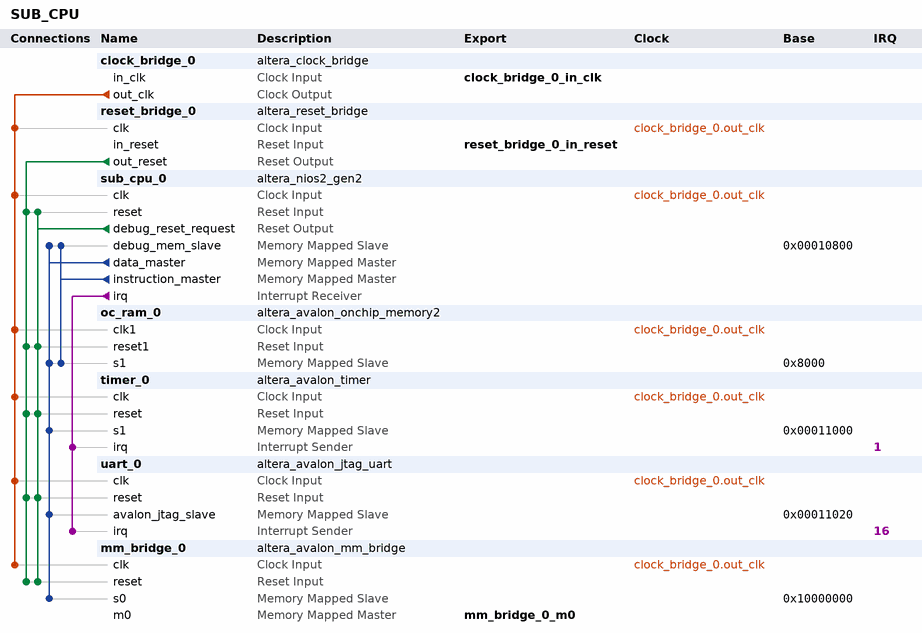
[diagram p0: system contents]
# Platform Designer (Qsys) system SUB_CPU, Cyclone IV E EP4CE115F29C7
# Parameters at their usual value, and those the tool derives, are not listed.
package require -exact qsys 18.1
create_system SUB_CPU
set_project_property DEVICE_FAMILY {Cyclone IV E}
set_project_property DEVICE EP4CE115F29C7

add_instance clock_bridge_0 altera_clock_bridge 18.1
set_instance_parameter_value clock_bridge_0 DERIVED_CLOCK_RATE 0
set_instance_parameter_value clock_bridge_0 EXPLICIT_CLOCK_RATE 75000000

add_instance reset_bridge_0 altera_reset_bridge 18.1
set_instance_parameter_value reset_bridge_0 ACTIVE_LOW_RESET 0
set_instance_parameter_value reset_bridge_0 SYNCHRONOUS_EDGES deassert

add_instance sub_cpu_0 altera_nios2_gen2 18.1
set_instance_parameter_value sub_cpu_0 dcache_size 2048
set_instance_parameter_value sub_cpu_0 exceptionSlave oc_ram_0.s1
set_instance_parameter_value sub_cpu_0 icache_size 4096
set_instance_parameter_value sub_cpu_0 impl Tiny
set_instance_parameter_value sub_cpu_0 resetSlave oc_ram_0.s1

add_instance oc_ram_0 altera_avalon_onchip_memory2 18.1
set_instance_parameter_value oc_ram_0 dataWidth 32
set_instance_parameter_value oc_ram_0 dualPort false
set_instance_parameter_value oc_ram_0 initMemContent true
set_instance_parameter_value oc_ram_0 initializationFileName onchip_mem.hex
set_instance_parameter_value oc_ram_0 memorySize 15360

add_instance timer_0 altera_avalon_timer 18.1
set_instance_parameter_value timer_0 period 1
set_instance_parameter_value timer_0 periodUnits MSEC

add_instance uart_0 altera_avalon_jtag_uart 18.1
set_instance_parameter_value uart_0 simInteractiveOptions NO_INTERACTIVE_WINDOWS

add_instance mm_bridge_0 altera_avalon_mm_bridge 18.1
set_instance_parameter_value mm_bridge_0 ADDRESS_UNITS SYMBOLS
set_instance_parameter_value mm_bridge_0 ADDRESS_WIDTH 32
set_instance_parameter_value mm_bridge_0 DATA_WIDTH 32
set_instance_parameter_value mm_bridge_0 MAX_PENDING_RESPONSES 4
set_instance_parameter_value mm_bridge_0 USE_AUTO_ADDRESS_WIDTH 1

# connections
add_connection clock_bridge_0.out_clk mm_bridge_0.clk clock
add_connection clock_bridge_0.out_clk oc_ram_0.clk1 clock
add_connection clock_bridge_0.out_clk reset_bridge_0.clk clock
add_connection clock_bridge_0.out_clk sub_cpu_0.clk clock
add_connection clock_bridge_0.out_clk timer_0.clk clock
add_connection clock_bridge_0.out_clk uart_0.clk clock
add_connection reset_bridge_0.out_reset mm_bridge_0.reset reset
add_connection reset_bridge_0.out_reset oc_ram_0.reset1 reset
add_connection reset_bridge_0.out_reset sub_cpu_0.reset reset
add_connection reset_bridge_0.out_reset timer_0.reset reset
add_connection reset_bridge_0.out_reset uart_0.reset reset
add_connection sub_cpu_0.debug_reset_request mm_bridge_0.reset reset
add_connection sub_cpu_0.debug_reset_request oc_ram_0.reset1 reset
add_connection sub_cpu_0.debug_reset_request sub_cpu_0.reset reset
add_connection sub_cpu_0.debug_reset_request timer_0.reset reset
add_connection sub_cpu_0.debug_reset_request uart_0.reset reset
add_connection sub_cpu_0.data_master mm_bridge_0.s0 avalon
set_connection_parameter_value sub_cpu_0.data_master/mm_bridge_0.s0 baseAddress 0x10000000
add_connection sub_cpu_0.data_master oc_ram_0.s1 avalon
set_connection_parameter_value sub_cpu_0.data_master/oc_ram_0.s1 baseAddress 0x8000
add_connection sub_cpu_0.data_master sub_cpu_0.debug_mem_slave avalon
set_connection_parameter_value sub_cpu_0.data_master/sub_cpu_0.debug_mem_slave baseAddress 0x00010800
add_connection sub_cpu_0.data_master timer_0.s1 avalon
set_connection_parameter_value sub_cpu_0.data_master/timer_0.s1 baseAddress 0x00011000
add_connection sub_cpu_0.data_master uart_0.avalon_jtag_slave avalon
set_connection_parameter_value sub_cpu_0.data_master/uart_0.avalon_jtag_slave baseAddress 0x00011020
add_connection sub_cpu_0.instruction_master oc_ram_0.s1 avalon
set_connection_parameter_value sub_cpu_0.instruction_master/oc_ram_0.s1 baseAddress 0x8000
add_connection sub_cpu_0.instruction_master sub_cpu_0.debug_mem_slave avalon
set_connection_parameter_value sub_cpu_0.instruction_master/sub_cpu_0.debug_mem_slave baseAddress 0x00010800
add_connection sub_cpu_0.irq timer_0.irq interrupt
set_connection_parameter_value sub_cpu_0.irq/timer_0.irq irqNumber 1
add_connection sub_cpu_0.irq uart_0.irq interrupt
set_connection_parameter_value sub_cpu_0.irq/uart_0.irq irqNumber 16

# exported interfaces
add_interface clock_bridge_0_in_clk clock sink
set_interface_property clock_bridge_0_in_clk EXPORT_OF clock_bridge_0.in_clk
add_interface mm_bridge_0_m0 avalon master
set_interface_property mm_bridge_0_m0 EXPORT_OF mm_bridge_0.m0
add_interface reset_bridge_0_in_reset reset sink
set_interface_property reset_bridge_0_in_reset EXPORT_OF reset_bridge_0.in_reset

set_interconnect_requirement {$system} qsys_mm.clockCrossingAdapter HANDSHAKE
set_interconnect_requirement {$system} qsys_mm.enableEccProtection FALSE
set_interconnect_requirement {$system} qsys_mm.insertDefaultSlave FALSE
set_interconnect_requirement {$system} qsys_mm.maxAdditionalLatency 1

save_system SUB_CPU.qsys
